# EasyEDA schematic ROBOCON_25_SCHEMATIC_json.json
TITLE: Sheet_1; REV: 1.0; Date: 2025-06-24; Sheet: 1/1; Drawn By: abdullahhafeez712; Company: Your Company
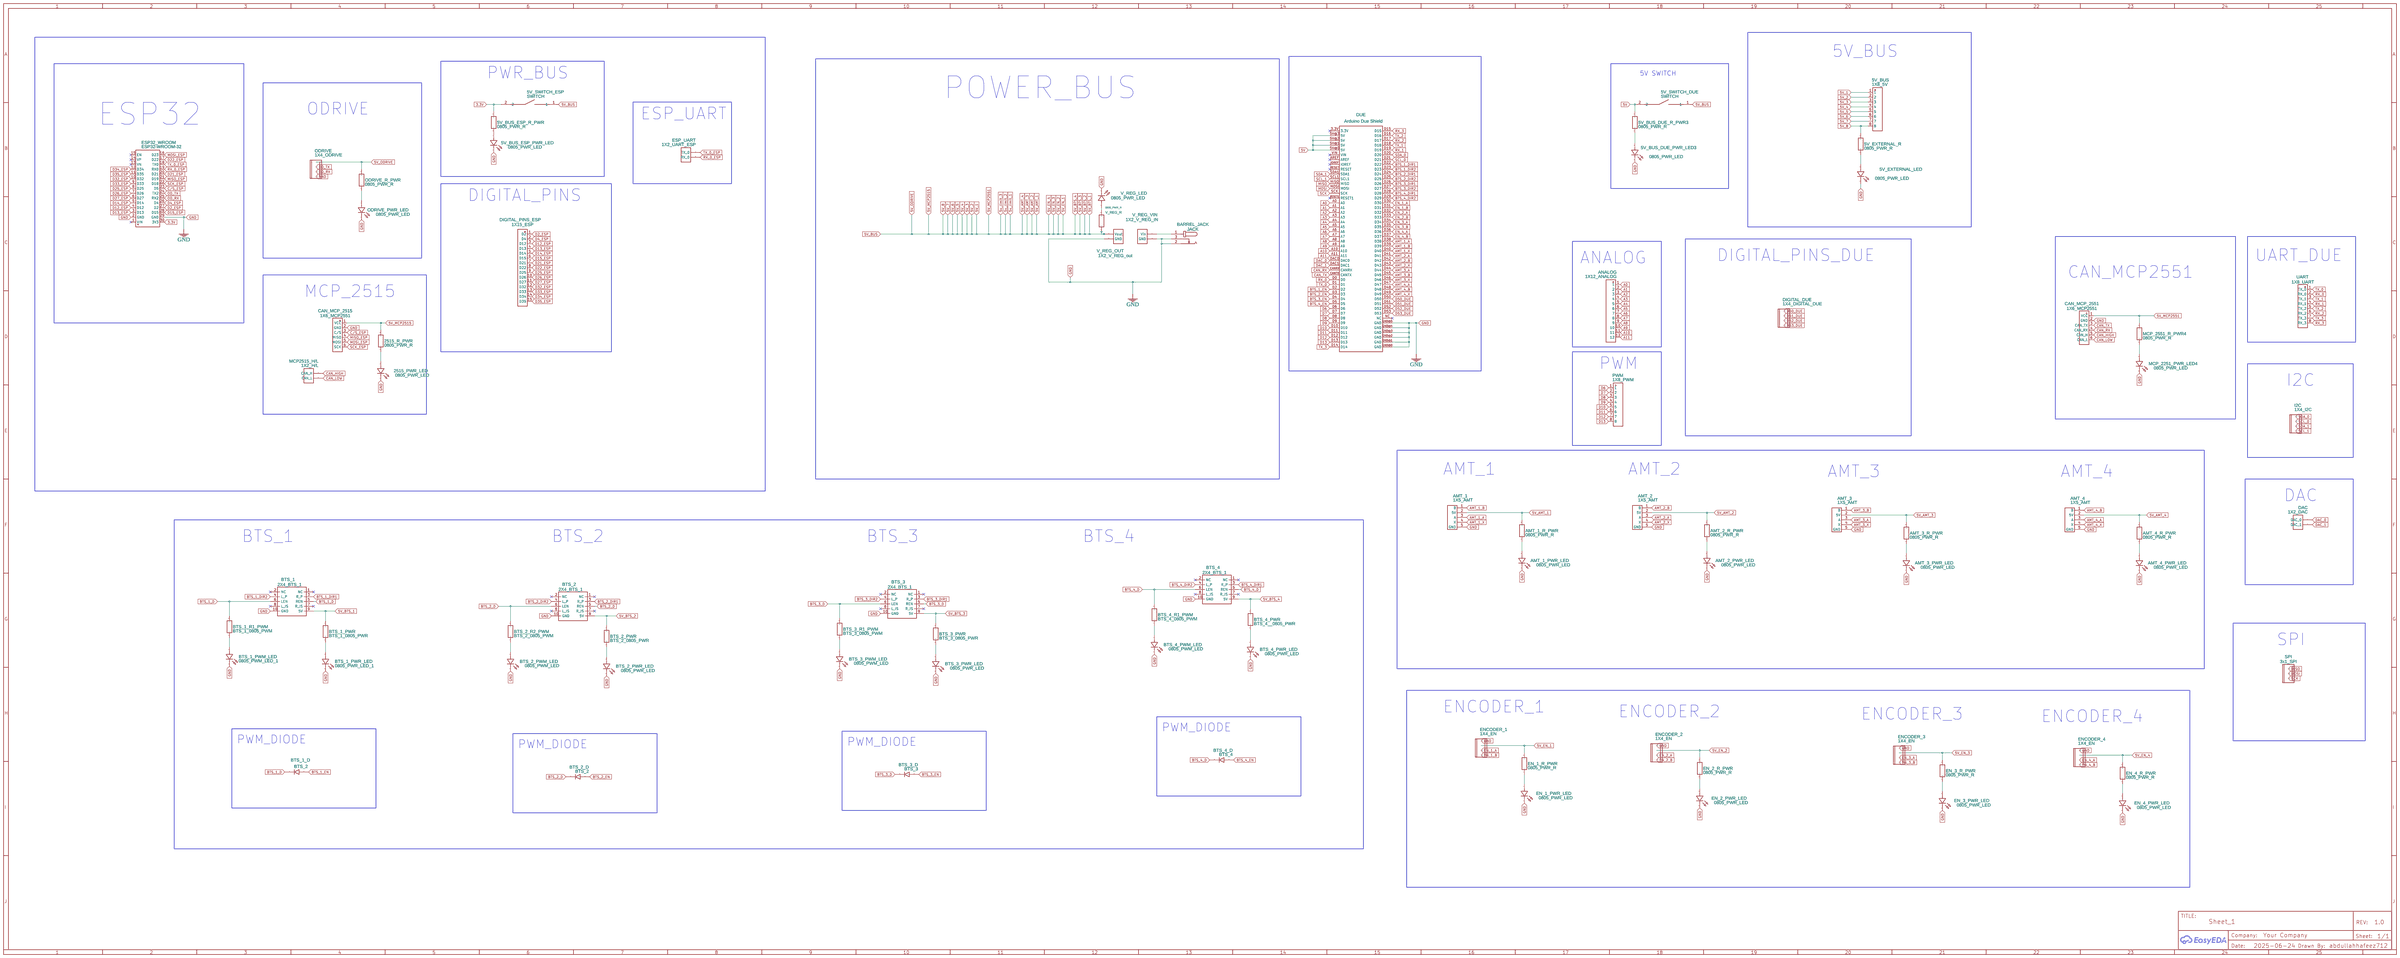
[diagram p0: schematic sheet]

## Parts
5V_BUS  1X8_5V  [CONN-TH_HC-PZ200-8.7L-1X8PZ]
5V_BUS_DUE_PWR_LED3  0805_PWR_LED  [LED0805-R-RD]
5V_BUS_DUE_R_PWR3  0805_PWR_R  [RESISTOR-SMD-1206]
5V_BUS_ESP_PWR_LED  0805_PWR_LED  [LED0805-R-RD]
5V_BUS_ESP_R_PWR  0805_PWR_R  [RESISTOR-SMD-1206]
5V_EXTERNAL_LED  0805_PWR_LED  [LED0805-R-RD]
5V_EXTERNAL_R  0805_PWR_R  [RESISTOR-SMD-1206]
5V_SWITCH_DUE  SWITCH  [TACTILE SWITCH SMD 2PIN]
5V_SWITCH_ESP  SWITCH  [TACTILE SWITCH SMD 2PIN]
2515_PWR_LED  0805_PWR_LED  [LED0805-R-RD]
2515_R_PWR  0805_PWR_R  [RESISTOR-SMD-1206]
AMT_1  1X5_AMT  [XHB-TH_5PIN-V-PITCH2.50-R]
AMT_1_PWR_LED  0805_PWR_LED  [LED0805-R-RD]
AMT_1_R_PWR  0805_PWR_R  [RESISTOR-SMD-1206]
AMT_2  1X5_AMT  [XHB-TH_5PIN-V-PITCH2.50-R]
AMT_2_PWR_LED  0805_PWR_LED  [LED0805-R-RD]
AMT_2_R_PWR  0805_PWR_R  [RESISTOR-SMD-1206]
AMT_3  1X5_AMT  [XHB-TH_5PIN-V-PITCH2.50-R]
AMT_3_PWR_LED  0805_PWR_LED  [LED0805-R-RD]
AMT_3_R_PWR  0805_PWR_R  [RESISTOR-SMD-1206]
AMT_4  1X5_AMT  [XHB-TH_5PIN-V-PITCH2.50-R]
AMT_4_PWR_LED  0805_PWR_LED  [LED0805-R-RD]
AMT_4_R_PWR  0805_PWR_R  [RESISTOR-SMD-1206]
ANALOG  1X12_ANALOG  [CONN-TH_12P-P2.00_KINGHELM_KH-2FH-1X12P-H4.3]
BARREL_JACK  JACK  [DC-IN-TH_PJ-002AH]
BTS_1  2X4_BTS_1  [IDC-10_(2X5)_2,54_BOX]
BTS_1_D  BTS_2  [IN4007]
BTS_1_PWM_LED  0805_PWM_LED_1  [LED0805-R-RD]
BTS_1_PWR  BTS_1_0805_PWR  [RESISTOR-SMD-1206]
BTS_1_PWR_LED  0805_PWR_LED_1  [LED0805-R-RD]
BTS_1_R1_PWM  BTS_1_0805_PWM  [RESISTOR-SMD-1206]
BTS_2  2X4_BTS_1  [IDC-10_(2X5)_2,54_BOX]
BTS_2_D  BTS_2  [IN4007]
BTS_2_PWM_LED  0805_PWM_LED  [LED0805-R-RD]
BTS_2_PWR  BTS_2_0805_PWR  [RESISTOR-SMD-1206]
BTS_2_PWR_LED  0805_PWR_LED  [LED0805-R-RD]
BTS_2_R2_PWM  BTS_2_0805_PWM  [RESISTOR-SMD-1206]
BTS_3  2X4_BTS_1  [IDC-10_(2X5)_2,54_BOX]
BTS_3_D  BTS_3  [IN4007]
BTS_3_PWM_LED  0805_PWM_LED  [LED0805-R-RD]
BTS_3_PWR  BTS_3_0805_PWR  [RESISTOR-SMD-1206]
BTS_3_PWR_LED  0805_PWR_LED  [LED0805-R-RD]
BTS_3_R1_PWM  BTS_3_0805_PWM  [RESISTOR-SMD-1206]
BTS_4  2X4_BTS_1  [IDC-10_(2X5)_2,54_BOX]
BTS_4_D  BTS_4  [IN4007]
BTS_4_PWM_LED  0805_PWM_LED  [LED0805-R-RD]
BTS_4_PWR  BTS_4__0805_PWR  [RESISTOR-SMD-1206]
BTS_4_PWR_LED  0805_PWR_LED  [LED0805-R-RD]
BTS_4_R1_PWM  BTS_4_0805_PWM  [RESISTOR-SMD-1206]
CAN_MCP_2515  1X6_MCP2551  [CONN-TH_DS1021-1X6SF11-B]
CAN_MCP_2551  1X6_MCP2551  [CONN-TH_DS1021-1X6SF11-B]
DAC  1X2_DAC  [2_PIN_HEADER]
DIGITAL_DUE  1X4_DIGITAL_DUE  [4PIN_RELIMATE_CONNECTOR]
DIGITAL_PINS_ESP  1X15_ESP  [CONN-TH_HC-PM200-4.3H-1X15PZ]
DUE  Arduino Due Shield  [ARDUINO DUE]
EN_1_PWR_LED  0805_PWR_LED  [LED0805-R-RD]
EN_1_R_PWR  0805_PWR_R  [RESISTOR-SMD-1206]
EN_2_PWR_LED  0805_PWR_LED  [LED0805-R-RD]
EN_2_R_PWR  0805_PWR_R  [RESISTOR-SMD-1206]
EN_3_PWR_LED  0805_PWR_LED  [LED0805-R-RD]
EN_3_R_PWR  0805_PWR_R  [RESISTOR-SMD-1206]
EN_4_PWR_LED  0805_PWR_LED  [LED0805-R-RD]
EN_4_R_PWR  0805_PWR_R  [RESISTOR-SMD-1206]
ENCODER_1  1X4_EN  [4PIN_RELIMATE_CONNECTOR]
ENCODER_2  1X4_EN  [4PIN_RELIMATE_CONNECTOR]
ENCODER_3  1X4_EN  [4PIN_RELIMATE_CONNECTOR]
ENCODER_4  1X4_EN  [4PIN_RELIMATE_CONNECTOR]
ESP32_WROOM  ESP32-WROOM-32  [ESP32-WROOM-32-30PIN]
ESP_UART  1X2_UART_ESP  [2_PIN_HEADER]
I2C  1X4_I2C  [4PIN_RELIMATE_CONNECTOR]
MCP2515_H/L  1X2_H/L  [2_PIN_HEADER]
MCP_2251_PWR_LED4  0805_PWR_LED  [LED0805-R-RD]
MCP_2551_R_PWR4  0805_PWR_R  [RESISTOR-SMD-1206]
ODRIVE  1X4_ODRIVE  [4PIN_RELIMATE_CONNECTOR]
ODRIVE_PWR_LED  0805_PWR_LED  [LED0805-R-RD]
ODRIVE_R_PWR  0805_PWR_R  [RESISTOR-SMD-1206]
PWM  1X8_PWM  [CONN-TH_HC-PZ200-8.7L-1X8PZ]
SPI  3x1_SPI  [3PIN_RELIMATE_CONNECTOR]
UART  1X8_UART  [CONN-TH_HC-PZ200-8.7L-1X8PZ]
V_REG_LED  0805_PWR_LED  [LED0805-R-RD]
V_REG_OUT  1X2_V_REG_out  [2_PIN_HEADER]
V_REG_R  0805_PWR_R  [RESISTOR-SMD-1206]
V_REG_VIN  1X2_V_REG_IN  [2_PIN_HEADER]

## Library data of the parts
5V_BUS PWM UART = HC-PZ200-8.7L-1X8PZ: Supplier: LCSC; Supplier Part: C27985157; Manufacturer: HC(虹成电子); Manufacturer Part: HC-PZ200-8.7L-1x8PZ; JLCPCB Part Class: Extended Part; Contributor: lcsc
5V_BUS_DUE_PWR_LED3 5V_BUS_ESP_PWR_LED 5V_EXTERNAL_LED 2515_PWR_LED AMT_1_PWR_LED AMT_2_PWR_LED AMT_3_PWR_LED AMT_4_PWR_LED BTS_1_PWM_LED BTS_1_PWR_LED BTS_2_PWM_LED BTS_2_PWR_LED BTS_3_PWM_LED BTS_3_PWR_LED BTS_4_PWM_LED BTS_4_PWR_LED EN_1_PWR_LED EN_2_PWR_LED EN_3_PWR_LED EN_4_PWR_LED MCP_2251_PWR_LED4 ODRIVE_PWR_LED V_REG_LED = YLED0805YG: Supplier: LCSC; Supplier Part: C19171393; Manufacturer: YONGYUTAI(永裕泰); Contributor: lcsc; JLCPCB Part Class: Extended Part
5V_BUS_DUE_R_PWR3 5V_BUS_ESP_R_PWR 5V_EXTERNAL_R 2515_R_PWR AMT_1_R_PWR AMT_2_R_PWR AMT_3_R_PWR AMT_4_R_PWR BTS_1_PWR BTS_1_R1_PWM BTS_2_PWR BTS_2_R2_PWM BTS_3_PWR BTS_3_R1_PWM BTS_4_PWR BTS_4_R1_PWM EN_1_R_PWR EN_2_R_PWR EN_3_R_PWR EN_4_R_PWR MCP_2551_R_PWR4 ODRIVE_R_PWR V_REG_R = RESISTOR-SMD-1206: Supplier: Banggood; Contributor: WalterHaazen
5V_SWITCH_DUE 5V_SWITCH_ESP = Tactile switch SMD 2 Pin: Contributor: Kumar_EVIQ
AMT_1-AMT_4 = XHB-5A: Supplier: LCSC; Manufacturer: BOOMELE(博穆精密); Supplier Part: C66559; JLCPCB Part Class: Extended Part
ANALOG = KH-2FH-1X12P-H4.3: Contributor: LCSC; Supplier: LCSC; Supplier Part: C2938435; Manufacturer: kinghelm(金航标); JLCPCB Part Class: Extended Part
BARREL_JACK = PJ-002AH: Supplier: LCSC; Supplier Part: C2961147; Manufacturer: CUI; JLCPCB Part Class: Extended Part; Contributor: lcsc
BTS_1-BTS_4 = IDC-10_(2X5)_2,54_BOX: Contributor: anabiozforever
BTS_1_D BTS_2_D BTS_3_D BTS_4_D = IN4007: Manufacturer Part: IRFD9120PbF; Contributor: 呂承樺
CAN_MCP_2515 CAN_MCP_2551 = DS1021-1X6SF11-B: Supplier: LCSC; Supplier Part: C7430362; Manufacturer: CONNFLY; Manufacturer Part: DS1021-1x6SF11-B; Contributor: lcsc; JLCPCB Part Class: Extended Part
DAC ESP_UART MCP2515_H/L V_REG_OUT V_REG_VIN = 2 pin RELIMATE copy: Manufacturer Part: RELIMATE CON 3 PIN; Contributor: amit071089
DIGITAL_DUE ENCODER_1-ENCODER_4 I2C ODRIVE = 4PIN_RELIMATE_CONNECTOR: Contributor: patalsenayan28
DIGITAL_PINS_ESP = HC-PM200-4.3H-1X15PZ: Supplier: LCSC; Supplier Part: C22373850; Manufacturer: HC(虹成电子); Manufacturer Part: HC-PM200-4.3H-1x15PZ; JLCPCB Part Class: Extended Part; Contributor: lcsc
DUE = Arduino Due Shield: Contributor: david.nieto.perez
ESP32_WROOM = ESP32-WROOM-32-30Pin: Contributor: fernandoluna1
SPI = 3PIN_RELIMATE_CONNECTOR: Contributor: Scikraft

## Nets
3.3V: 5V_BUS_ESP_R_PWR.2 5V_SWITCH_ESP.2 ESP32_WROOM.30(3V3)
5V: 5V_BUS_DUE_R_PWR3.2 5V_SWITCH_DUE.2 DUE.5V@0(5V) DUE.5V@1(5V) DUE.5V@2(5V) DUE.5V@3(5V)
5V_1: 5V_BUS.1 5V_BUS.2 5V_BUS.3 5V_BUS.4 5V_BUS.5 5V_BUS.6 5V_BUS.7 5V_BUS.8 5V_EXTERNAL_R.2 5V_SWITCH_DUE.1 5V_SWITCH_ESP.1 2515_R_PWR.2 AMT_1.2(5V) AMT_1_R_PWR.2 AMT_2.2(5V) AMT_2_R_PWR.2 AMT_3.2(5V) AMT_3_R_PWR.2 AMT_4.2(5V) AMT_4_R_PWR.2 BTS_1.9(5V) BTS_1_PWR.2 BTS_2.9(5V) BTS_2_PWR.2 BTS_3.9(5V) BTS_3_PWR.2 BTS_4.9(5V) BTS_4_PWR.2 CAN_MCP_2515.1(VCC) CAN_MCP_2551.1(VCC) EN_1_R_PWR.2 EN_2_R_PWR.2 EN_3_R_PWR.2 EN_4_R_PWR.2 ENCODER_1.3(A) ENCODER_2.3(A) ENCODER_3.3(A) ENCODER_4.3(A) MCP_2551_R_PWR4.2 ODRIVE.4(GND) ODRIVE_R_PWR.2 V_REG_OUT.1(Vout) V_REG_R.1
GND: 5V_BUS_DUE_PWR_LED3.2 5V_BUS_ESP_PWR_LED.2 5V_EXTERNAL_LED.2 2515_PWR_LED.2 AMT_1.5(GND) AMT_1_PWR_LED.2 AMT_2.5(GND) AMT_2_PWR_LED.2 AMT_3.5(GND) AMT_3_PWR_LED.2 AMT_4.5(GND) AMT_4_PWR_LED.2 BARREL_JACK.2 BARREL_JACK.3 BTS_1.10(GND) BTS_1_PWM_LED.2 BTS_1_PWR_LED.2 BTS_2.10(GND) BTS_2_PWM_LED.2 BTS_2_PWR_LED.2 BTS_3.10(GND) BTS_3_PWM_LED.2 BTS_3_PWR_LED.2 BTS_4.10(GND) BTS_4_PWM_LED.2 BTS_4_PWR_LED.2 CAN_MCP_2515.2(GND) CAN_MCP_2551.2(GND) DUE.GND@0(GND) DUE.GND@1(GND) DUE.GND@2(GND) DUE.GND@3(GND) DUE.GND@4(GND) DUE.GND@5(GND) EN_1_PWR_LED.2 EN_2_PWR_LED.2 EN_3_PWR_LED.2 EN_4_PWR_LED.2 ENCODER_1.4(GND) ENCODER_2.4(GND) ENCODER_3.4(GND) ENCODER_4.4(GND) ESP32_WROOM.2(GND) ESP32_WROOM.29(GND) MCP_2251_PWR_LED4.2 ODRIVE.1(VCC) ODRIVE_PWR_LED.2 V_REG_LED.2 V_REG_OUT.2(GND) V_REG_VIN.2(GND)
A0: ANALOG.1 DUE.A0
A1: ANALOG.2 DUE.A1
A2: ANALOG.3 DUE.A2
A3: ANALOG.4 DUE.A3
A4: ANALOG.5 DUE.A4
A5: ANALOG.6 DUE.A5
A6: ANALOG.7 DUE.A6
A7: ANALOG.8 DUE.A7
A8: ANALOG.9 DUE.A8
A9: ANALOG.10 DUE.A9
A10: ANALOG.11 DUE.A10
A11: ANALOG.12 DUE.A11
AMT_1_A: AMT_1.3(A) DUE.D38
AMT_1_B: AMT_1.1(B) DUE.D39
AMT_1_X: AMT_1.4(X) DUE.D40
AMT_2_A: AMT_2.3(A) DUE.D41
AMT_2_B: AMT_2.1(B) DUE.D42
AMT_2_X: AMT_2.4(X) DUE.D43
AMT_3_A: AMT_3.3(A) DUE.D44
AMT_3_B: AMT_3.1(B) DUE.D45
AMT_3_X: AMT_3.4(X) DUE.D46
AMT_4_A: AMT_4.3(A) DUE.D47
AMT_4_B: AMT_4.1(B) DUE.D48
AMT_4_X: AMT_4.4(X) DUE.D49
BTS_1_D: BTS_1.5(REN) BTS_1.6(LEN) BTS_1_D.1 BTS_1_R1_PWM.2
BTS_1_DIR1: BTS_1.3(R_P) DUE.D22
BTS_1_DIR2: BTS_1.4(L_P) DUE.D23
BTS_1_EN: BTS_1_D.2 DUE.D2
BTS_2_D: BTS_2.5(REN) BTS_2.6(LEN) BTS_2_D.1 BTS_2_R2_PWM.2
BTS_2_DIR1: BTS_2.3(R_P) DUE.D24
BTS_2_DIR2: BTS_2.4(L_P) DUE.D25
BTS_2_EN: BTS_2_D.2 DUE.D3
BTS_3_D: BTS_3.5(REN) BTS_3.6(LEN) BTS_3_D.1 BTS_3_R1_PWM.2
BTS_3_DIR1: BTS_3.3(R_P) DUE.D26
BTS_3_DIR2: BTS_3.4(L_P) DUE.D27
BTS_3_EN: BTS_3_D.2 DUE.D4
BTS_4_D: BTS_4.5(REN) BTS_4.6(LEN) BTS_4_D.1 BTS_4_R1_PWM.2
BTS_4_DIR1: BTS_4.3(R_P) DUE.D28
BTS_4_DIR2: BTS_4.4(L_P) DUE.D29
BTS_4_EN: BTS_4_D.2 DUE.D5
C/S_ESP: CAN_MCP_2515.3(C/S) ESP32_WROOM.23(D5)
CAN_HIGH: CAN_MCP_2551.5(CAN_H) MCP2515_H/L.1(CAN_H)
CAN_LOW: CAN_MCP_2551.6(CAN_L) MCP2515_H/L.2(CAN_L)
CAN_RX: CAN_MCP_2551.4(CAN_RX) DUE.CANRX
CAN_TX: CAN_MCP_2551.3(CAN_TX) DUE.CANTX
D2_ESP: DIGITAL_PINS_ESP.1(D2) ESP32_WROOM.27(D2)
D4_ESP: DIGITAL_PINS_ESP.2(D4) ESP32_WROOM.26(D4)
D6: DUE.D6 PWM.1
D7: DUE.D7 PWM.2
D8: DUE.D8 PWM.3
D9: DUE.D9 PWM.4
D10: DUE.D10 PWM.5
D11: DUE.D11 PWM.6
D12: DUE.D12 PWM.7
D12_ESP: DIGITAL_PINS_ESP.3(D12) ESP32_WROOM.4(D12)
D13: DUE.D13 PWM.8
D13_ESP: DIGITAL_PINS_ESP.4(D13) ESP32_WROOM.3(D13)
D14_ESP: DIGITAL_PINS_ESP.5(D14) ESP32_WROOM.5(D14)
D15_ESP: DIGITAL_PINS_ESP.6(D15) ESP32_WROOM.28(D15)
D21_ESP: DIGITAL_PINS_ESP.7(D21) ESP32_WROOM.20(D21)
D22_ESP: DIGITAL_PINS_ESP.8(D22) ESP32_WROOM.17(D22)
D25_ESP: DIGITAL_PINS_ESP.9(D25) ESP32_WROOM.8(D25)
D26_ESP: DIGITAL_PINS_ESP.10(D26) ESP32_WROOM.7(D26)
D27_ESP: DIGITAL_PINS_ESP.11(D27) ESP32_WROOM.6(D27)
D32_ESP: DIGITAL_PINS_ESP.12(D32) ESP32_WROOM.10(D32)
D33_ESP: DIGITAL_PINS_ESP.13(D33) ESP32_WROOM.9(D33)
D34_ESP: DIGITAL_PINS_ESP.14(D34) ESP32_WROOM.12(D34)
D35_ESP: DIGITAL_PINS_ESP.15(D35) ESP32_WROOM.11(D35)
D50_DUE: DIGITAL_DUE.4(D40) DUE.D50
D51_DUE: DIGITAL_DUE.3(D51) DUE.D51
D52_DUE: DIGITAL_DUE.2(D52) DUE.D52
D53_DUE: DIGITAL_DUE.1(D53) DUE.D53
DAC_0: DAC.1(DAC_0) DUE.DAC0
DAC_1: DAC.2(DAC_1) DUE.DAC1
EN_1_A: DUE.D30 ENCODER_1.2(B)
EN_1_B: DUE.D31 ENCODER_1.1(VCC)
EN_2_A: DUE.D32 ENCODER_2.2(B)
EN_2_B: DUE.D33 ENCODER_2.1(VCC)
EN_3_A: DUE.D34 ENCODER_3.2(B)
EN_3_B: DUE.D35 ENCODER_3.1(VCC)
EN_4_A: DUE.D36 ENCODER_4.2(B)
EN_4_B: DUE.D37 ENCODER_4.1(VCC)
MISO: DUE.MISO SPI.3(MISO)
MISO_ESP: CAN_MCP_2515.4(MISO) ESP32_WROOM.21(D19)
MOSI: DUE.MOSI SPI.2(MOSI)
MOSI_ESP: CAN_MCP_2515.5(MOSI) ESP32_WROOM.16(D23)
OD_RX: ESP32_WROOM.25(RX2) ODRIVE.2(B)
OD_TX: ESP32_WROOM.24(TX2) ODRIVE.3(A)
RX_0: DUE.D0 UART.2(RX_0)
RX_0_ESP: ESP32_WROOM.19(RX0) ESP_UART.2(RX_0)
RX_1: DUE.D19 UART.4(RX_1)
RX_2: DUE.D17 UART.6(RX_2)
RX_3: DUE.D15 UART.8(RX_3)
SCK: DUE.SCK SPI.1(SCK)
SCK_ESP: CAN_MCP_2515.6(SCK) ESP32_WROOM.22(D18)
SCL_0: DUE.D21 I2C.3(SCL_0)
SCL_1: DUE.SCL1 I2C.1(SCL)
SDA_0: DUE.D20 I2C.4(SDA_0)
SDA_1: DUE.SDA1 I2C.2(SDA_1)
TX_0: DUE.D1 UART.1(TX_0)
TX_0_ESP: ESP32_WROOM.18(TX0) ESP_UART.1(TX_0)
TX_1: DUE.D18 UART.3(TX_1)
TX_2: DUE.D16 UART.5(TX_2)
TX_3: DUE.D14 UART.7(TX_3)
Net-(5V_BUS_DUE_PWR_LED3-1): 5V_BUS_DUE_PWR_LED3.1 5V_BUS_DUE_R_PWR3.1
Net-(5V_BUS_ESP_PWR_LED-1): 5V_BUS_ESP_PWR_LED.1 5V_BUS_ESP_R_PWR.1
Net-(5V_EXTERNAL_LED-1): 5V_EXTERNAL_LED.1 5V_EXTERNAL_R.1
Net-(2515_PWR_LED-1): 2515_PWR_LED.1 2515_R_PWR.1
Net-(AMT_1_PWR_LED-1): AMT_1_PWR_LED.1 AMT_1_R_PWR.1
Net-(AMT_2_PWR_LED-1): AMT_2_PWR_LED.1 AMT_2_R_PWR.1
Net-(AMT_3_PWR_LED-1): AMT_3_PWR_LED.1 AMT_3_R_PWR.1
Net-(AMT_4_PWR_LED-1): AMT_4_PWR_LED.1 AMT_4_R_PWR.1
Net-(BARREL_JACK-1): BARREL_JACK.1 V_REG_VIN.1(Vin)
Net-(BTS_1_PWM_LED-1): BTS_1_PWM_LED.1 BTS_1_R1_PWM.1
Net-(BTS_1_PWR-1): BTS_1_PWR.1 BTS_1_PWR_LED.1
Net-(BTS_2_PWM_LED-1): BTS_2_PWM_LED.1 BTS_2_R2_PWM.1
Net-(BTS_2_PWR-1): BTS_2_PWR.1 BTS_2_PWR_LED.1
Net-(BTS_3_PWM_LED-1): BTS_3_PWM_LED.1 BTS_3_R1_PWM.1
Net-(BTS_3_PWR-1): BTS_3_PWR.1 BTS_3_PWR_LED.1
Net-(BTS_4_PWM_LED-1): BTS_4_PWM_LED.1 BTS_4_R1_PWM.1
Net-(BTS_4_PWR-1): BTS_4_PWR.1 BTS_4_PWR_LED.1
Net-(EN_1_PWR_LED-1): EN_1_PWR_LED.1 EN_1_R_PWR.1
Net-(EN_2_PWR_LED-1): EN_2_PWR_LED.1 EN_2_R_PWR.1
Net-(EN_3_PWR_LED-1): EN_3_PWR_LED.1 EN_3_R_PWR.1
Net-(EN_4_PWR_LED-1): EN_4_PWR_LED.1 EN_4_R_PWR.1
Net-(MCP_2251_PWR_LED4-1): MCP_2251_PWR_LED4.1 MCP_2551_R_PWR4.1
Net-(ODRIVE_PWR_LED-1): ODRIVE_PWR_LED.1 ODRIVE_R_PWR.1
Net-(V_REG_LED-1): V_REG_LED.1 V_REG_R.2

Not connected (* = marked no-connect by the designer): BTS_1 1(NC)* 2(NC)* 7(R_IS)* 8(L_IS)*; BTS_2 1(NC)* 2(NC)* 7(R_IS)* 8(L_IS)*; BTS_3 1(NC)* 2(NC)* 7(R_IS)* 8(L_IS)*; BTS_4 1(NC)* 2(NC)* 7(R_IS)* 8(L_IS)*; DUE 3.3V* AREF* IOREF* NC* RESET* RESET1* VIN*; ESP32_WROOM 1(VIN)* 13(VN)* 14(VP)* 15(EN)*

## Notes on the sheet
- 5V_BUS
- PWR_BUS
- 5V SWITCH
- POWER_BUS
- ESP32
- ODRIVE
- ESP_UART
- DIGITAL_PINS
- DIGITAL_PINS_DUE
- UART_DUE
- ANALOG
- CAN_MCP2551
- MCP_2515
- PWM
- I2C
- AMT_1
- AMT_2
- AMT_3
- AMT_4
- DAC
- BTS_1
- BTS_2
- BTS_3
- BTS_4
- SPI
- ENCODER_1
- ENCODER_2
- ENCODER_3
- ENCODER_4
- PWM_DIODE
- PWM_DIODE
- PWM_DIODE
- PWM_DIODE
